# Altium project AUDIO.PrjPcb
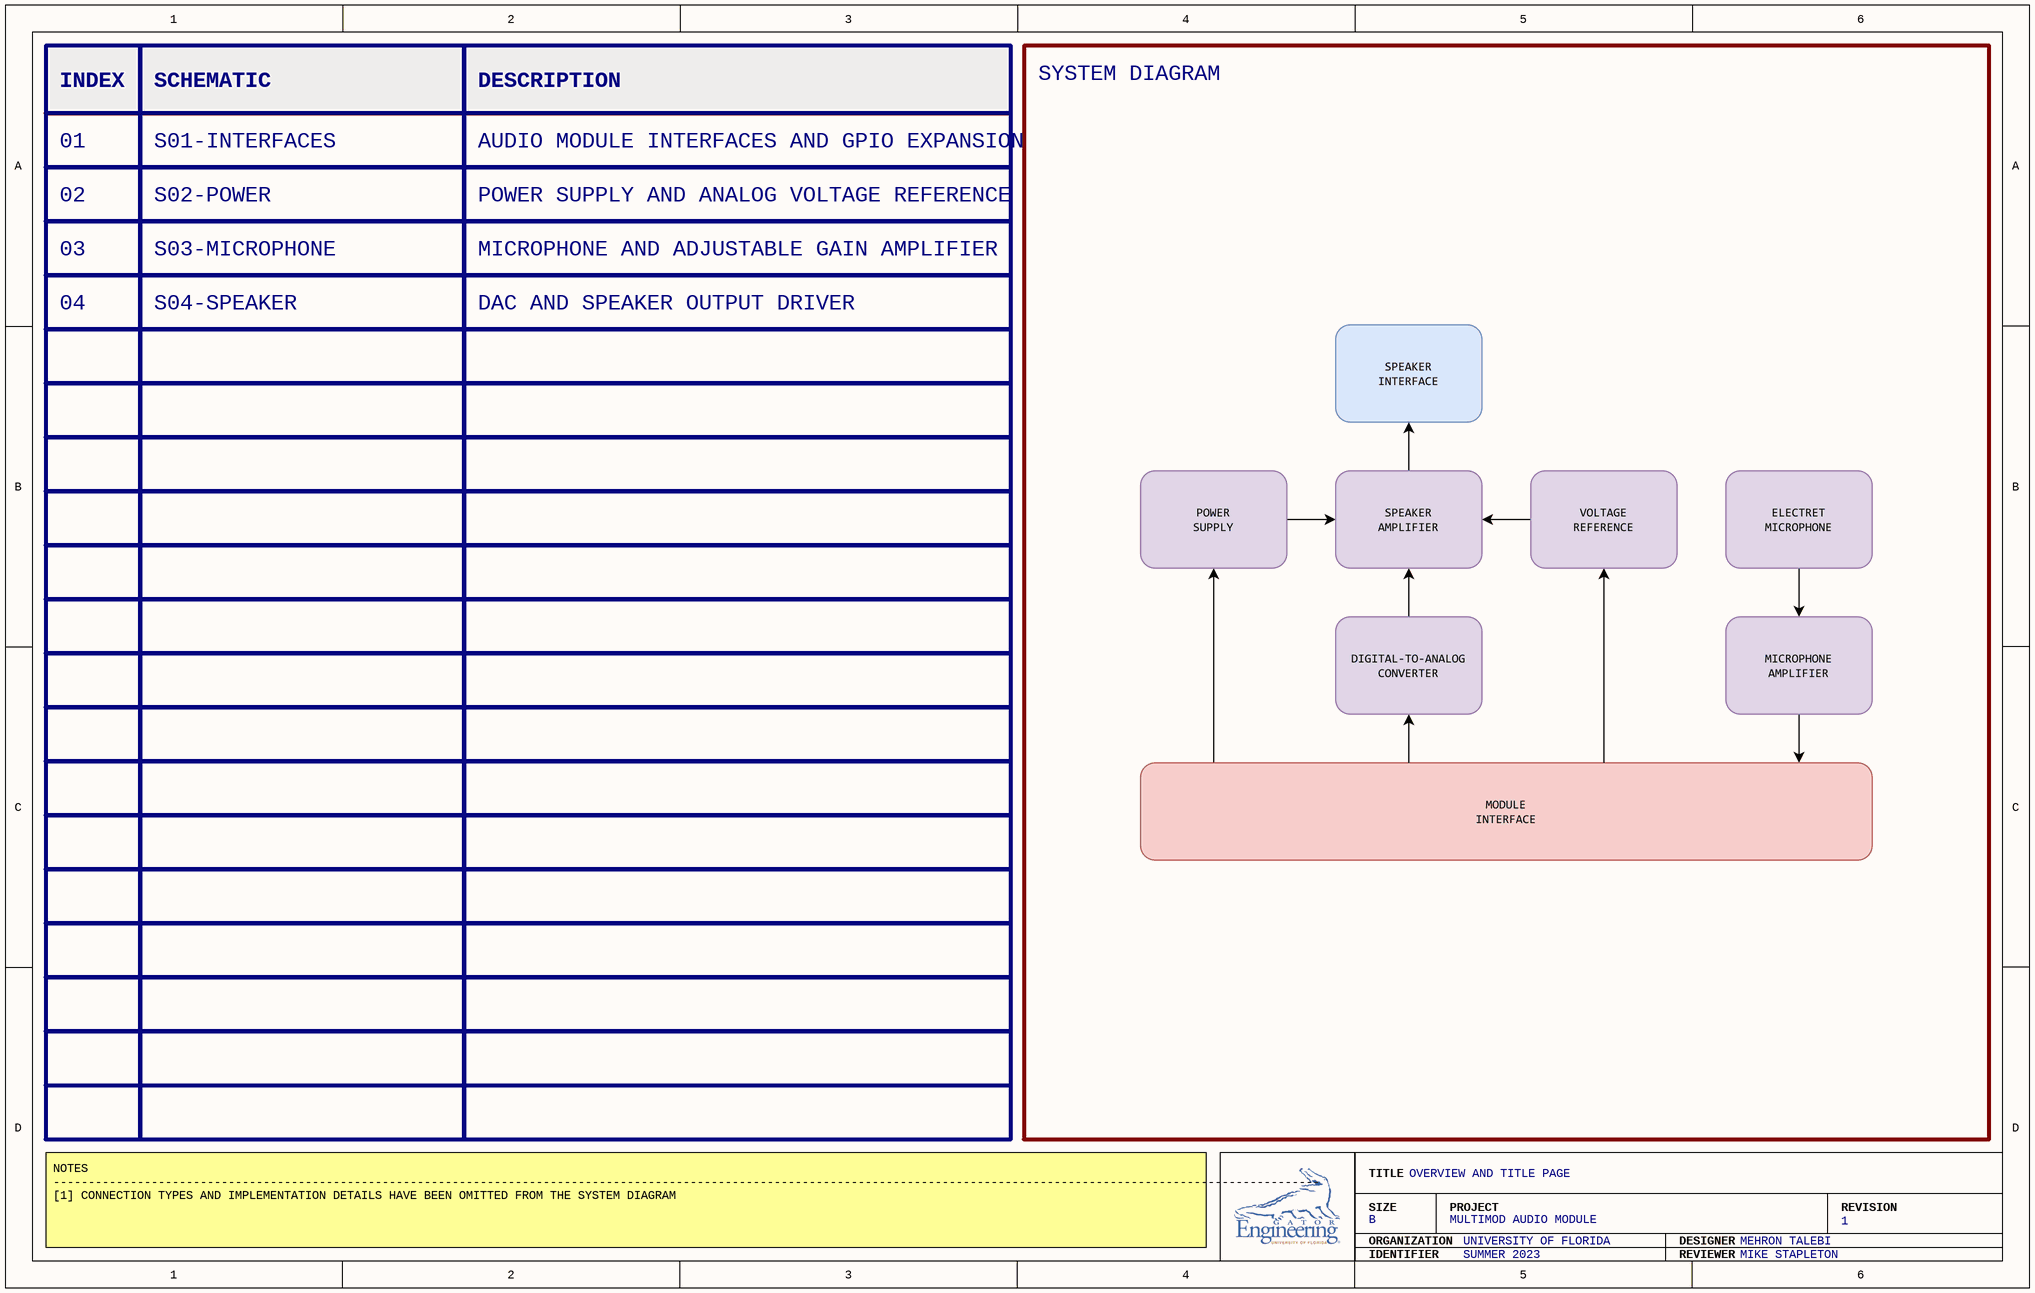
[diagram p0: S00-OVERVIEW.SchDoc]
5 sheets, 42 parts. Net scope: flat (ports and power ports of the same name join across sheets).
Board file: P01-AUDIO.PcbDoc
Sheets:
  S00-OVERVIEW.SchDoc
  S01-INTERFACES.SchDoc
  S02-POWER.SchDoc
  S03-MICROPHONE.SchDoc
  S04-SPEAKER.SchDoc

## Sheet S00-OVERVIEW.SchDoc
size B; SheetNumber: 1; SheetTotal: 5; BLOCK-TITLE: OVERVIEW AND TITLE PAGE; BLOCK-SIZE: B; BLOCK-PROJECT: MULTIMOD AUDIO MODULE; BLOCK-REVISION: 1; BLOCK-ORGANIZATION: UNIVERSITY OF FLORIDA; BLOCK-DESIGNER: MEHRON TALEBI; BLOCK-IDENTIFIER: SUMMER 2023; BLOCK-REVIEWER: MIKE STAPLETON

### Notes on the sheet
- INDEX
- SCHEMATIC
- DESCRIPTION
- SYSTEM DIAGRAM
- 01
- S01-INTERFACES
- AUDIO MODULE INTERFACES AND GPIO EXPANSION
- 02
- 03
- S02-POWER
- S03-MICROPHONE
- POWER SUPPLY AND ANALOG VOLTAGE REFERENCE
- MICROPHONE AND ADJUSTABLE GAIN AMPLIFIER
- 04
- S04-SPEAKER
- DAC AND SPEAKER OUTPUT DRIVER
- NOTES
  -------------------------------------------------------------------------------------------------------------------------------------------------------------------------------------
  [1] CONNECTION TYPES AND IMPLEMENTATION DETAILS HAVE BEEN OMITTED FROM THE SYSTEM DIAGRAM
- TITLE
- SIZE
- ORGANIZATION
- PROJECT
- DESIGNER
- REVISION
- IDENTIFIER
- REVIEWER

## Sheet S01-INTERFACES.SchDoc
size B; SheetNumber: 2; SheetTotal: 5; BLOCK-TITLE: AUDIO MODULE INTERFACES AND GPIO EXPANSION; BLOCK-SIZE: B; BLOCK-PROJECT: MULTIMOD AUDIO MODULE; BLOCK-REVISION: 1; BLOCK-ORGANIZATION: UNIVERSITY OF FLORIDA; BLOCK-DESIGNER: MEHRON TALEBI; BLOCK-IDENTIFIER: SUMMER 2023; BLOCK-REVIEWER: MIKE STAPLETON
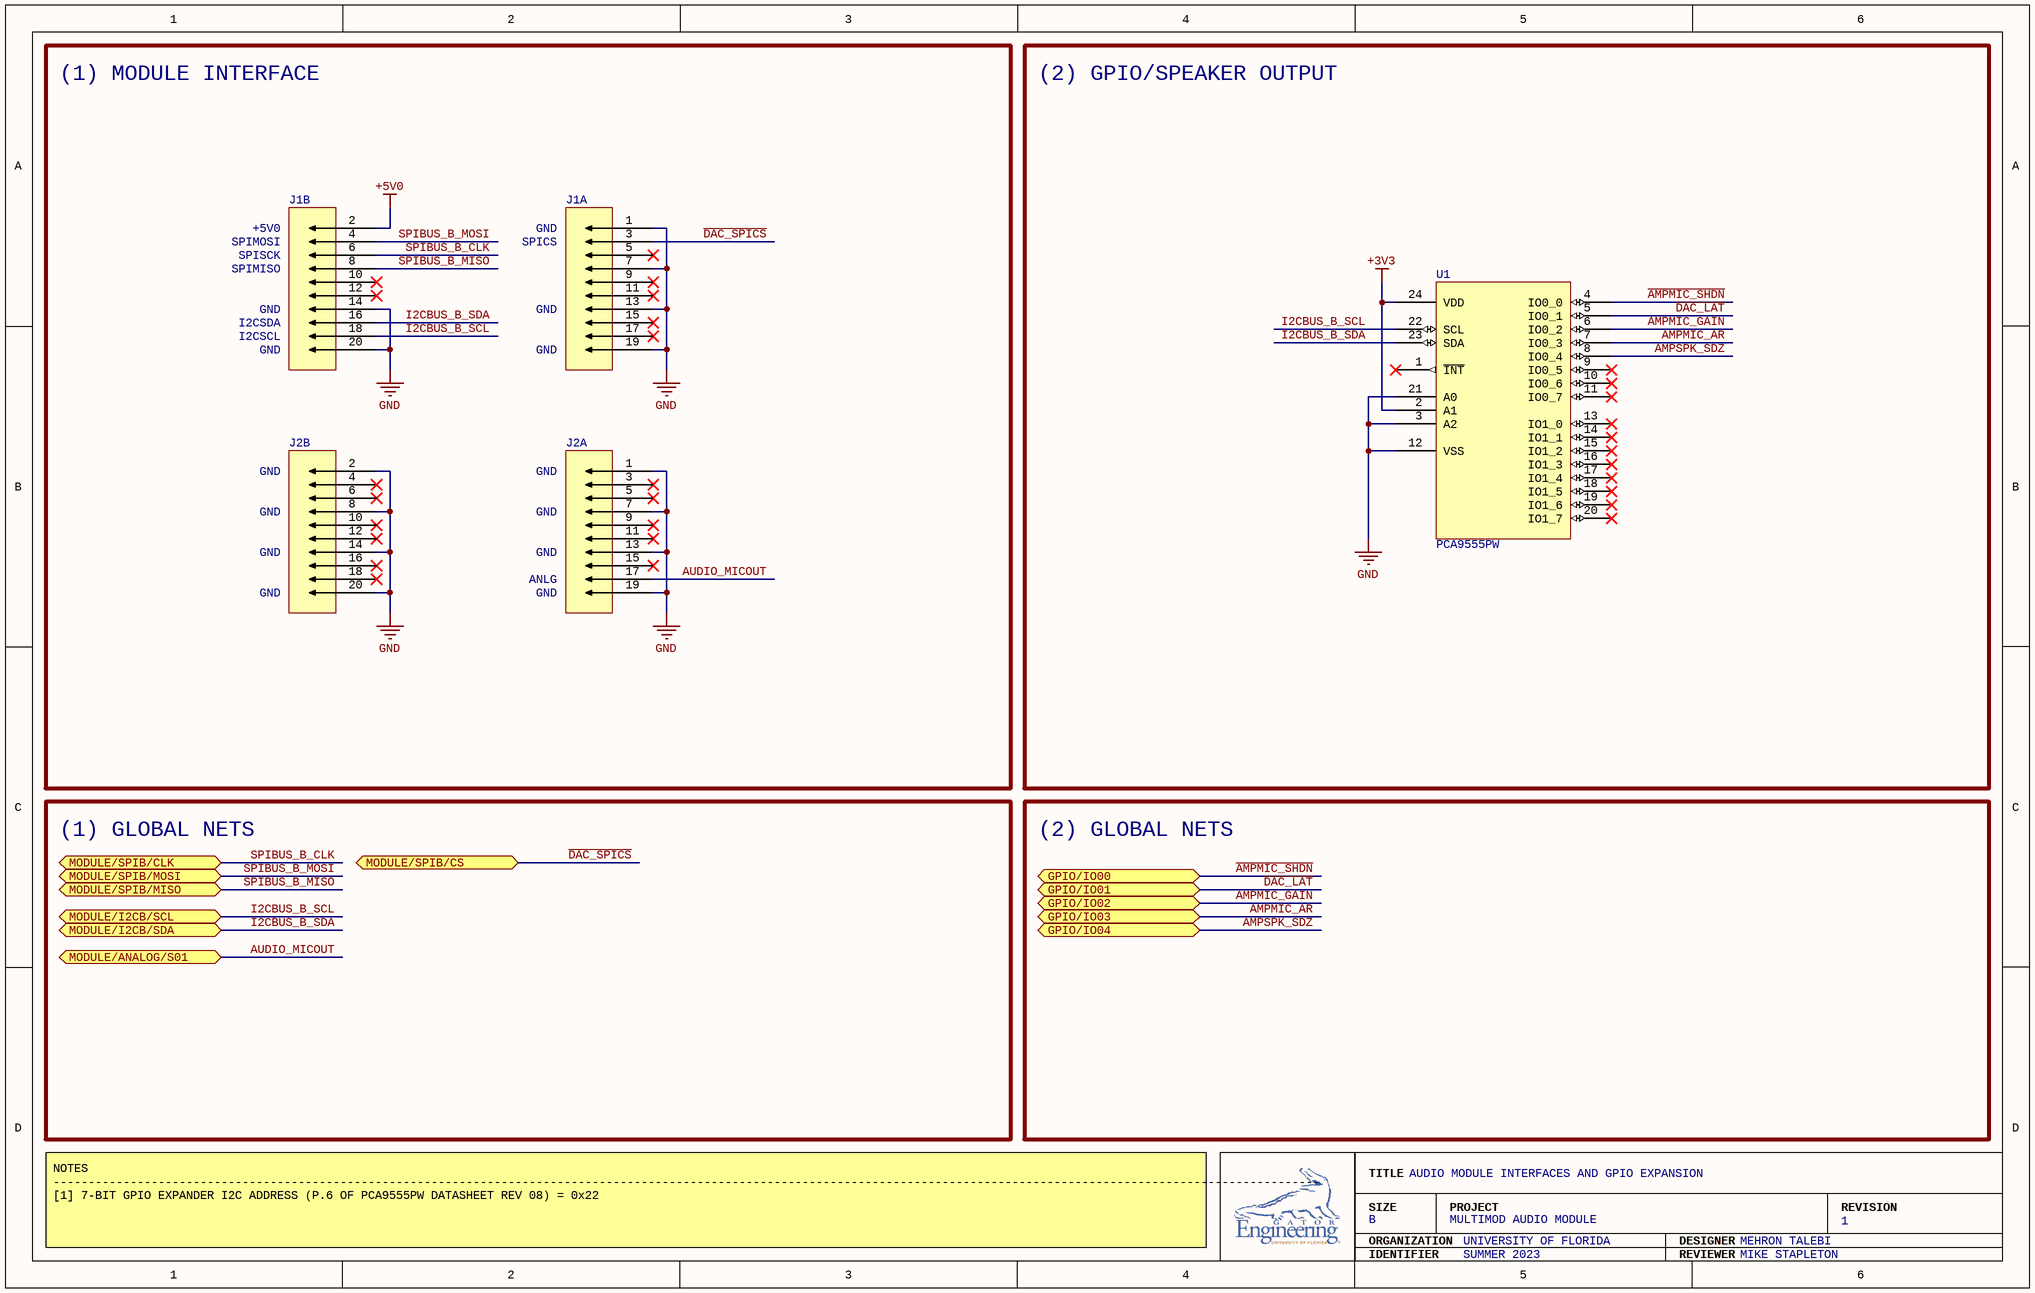
[diagram p1: S01-INTERFACES.SchDoc]

### Parts
J1  NPTC102KFMS-RC  [NPTC102KFMS-RC]  (value not drawn)  (parts A,B of 2)
J2  NPTC102KFMS-RC  [NPTC102KFMS-RC]  (value not drawn)  (parts A,B of 2)
U1  PCA9555PW  [PCA9555PW]

### Blocks framed on the sheet
(1) MODULE INTERFACE: J1 J2
(2) GPIO/SPEAKER OUTPUT: U1

### Ports
GPIO/IO00 (bidir), GPIO/IO01 (bidir), GPIO/IO02 (bidir), GPIO/IO03 (bidir), GPIO/IO04 (bidir), MODULE/ANALOG/S01 (bidir), MODULE/I2CB/SCL (bidir), MODULE/I2CB/SDA (bidir), MODULE/SPIB/CLK (bidir), MODULE/SPIB/CS (bidir), MODULE/SPIB/MISO (bidir), MODULE/SPIB/MOSI (bidir)

### Nets
+3V3: U1.2(A1) U1.24(VDD)
+5V0: J1.2
GND: J1.1 J1.7 J1.13 J1.14 J1.19 J1.20 J2.1 J2.2 J2.7 J2.8 J2.13 J2.14 J2.19 J2.20 U1.3(A2) U1.12(VSS) U1.21(A0)
~{AMPMIC_SHDN}: U1.4(IO0_0) ; port GPIO/IO00
~{DAC_LAT}: U1.5(IO0_1) ; port GPIO/IO01
~{DAC_SPICS}: J1.3 ; port MODULE/SPIB/CS
AMPMIC_AR: U1.7(IO0_3) ; port GPIO/IO03
AMPMIC_GAIN: U1.6(IO0_2) ; port GPIO/IO02
AMPSPK_SDZ: U1.8(IO0_4) ; port GPIO/IO04
AUDIO_MICOUT: J2.17 ; port MODULE/ANALOG/S01
I2CBUS_B_SCL: J1.18 U1.22(SCL) ; port MODULE/I2CB/SCL
I2CBUS_B_SDA: J1.16 U1.23(SDA) ; port MODULE/I2CB/SDA
SPIBUS_B_CLK: J1.6 ; port MODULE/SPIB/CLK
SPIBUS_B_MISO: J1.8 ; port MODULE/SPIB/MISO
SPIBUS_B_MOSI: J1.4 ; port MODULE/SPIB/MOSI

Not connected (* = marked no-connect by the designer): J1 5* 9* 10* 11* 12* 15* 17*; J2 3* 4* 5* 6* 9* 10* 11* 12* 15* 16* 18*; U1 1(~{INT})* 9(IO0_5)* 10(IO0_6)* 11(IO0_7)* 13(IO1_0)* 14(IO1_1)* 15(IO1_2)* 16(IO1_3)* 17(IO1_4)* 18(IO1_5)* 19(IO1_6)* 20(IO1_7)*

### Notes on the sheet
- +5V0
- SPIMOSI
- SPICS
- GND
- SPISCK
- SPIMISO
- I2CSCL
- I2CSDA
- ANLG
- (1) GLOBAL NETS
- (2) GLOBAL NETS
- NOTES
  -------------------------------------------------------------------------------------------------------------------------------------------------------------------------------------
  [1] 7-BIT GPIO EXPANDER I2C ADDRESS (P.6 OF PCA9555PW DATASHEET REV 08) = 0x22
- TITLE
- SIZE
- ORGANIZATION
- PROJECT
- DESIGNER
- REVISION
- IDENTIFIER
- REVIEWER

### Library data of the parts
J1 J2 = NPTC102KFMS-RC: CONN HDR 20POS 0.1 TIN SMD; Connector Type: Header; Style: Board to Board; Number of Positions: 20; Number of Positions Loaded: All; Pitch - Mating: 0.100" (2.54mm); Material Flammability Rating: UL94 V-0; Current Rating (Amps): 3A; Voltage Rating: 250V; System: Connector; Contact Type: Female Socket; Number of Rows: 2; Row Spacing - Mating: 0.100" (2.54mm); Mounting Type: Surface Mount; Termination: Solder; Fastening Type: Push-Pull; Contact Finish - Mating: Tin; Insulation Color: Black; Insulation Height: 0.299" (7.60mm); Operating Temperature: -40°C ~ 125°C; Contact Finish - Post: Tin; Insulation Material: Polyamide (PA6T), Nylon 6T; Contact Shape: Square; Contact Material: Phosphor Bronze; Supplier 1: Digi-Key; Supplier Part Number 1: S5680-ND
U1 = PCA9555PW: IC XPND 400KHZ I2C SMBUS 24TSSOP; Number of I/O: 16; Interface: I²C, SMBus; Interrupt Output: Yes; Output Type: Push-Pull; Current - Output Source/Sink: 10mA, 25mA; Voltage - Supply: 2.3V ~ 5.5V; Features: POR; Clock Frequency: 400 kHz; Operating Temperature: -40°C ~ 85°C; Mounting Type: Surface Mount; Package / Case: 24-TSSOP (0.173", 4.40mm Width); Supplier Device Package: 24-TSSOP; Supplier 1: Newark; Supplier Part Number 1: 24AC9600

## Sheet S02-POWER.SchDoc
size B; SheetNumber: 3; SheetTotal: 5; BLOCK-TITLE: POWER SUPPLY AND ANALOG VOLTAGE REFERENCE; BLOCK-SIZE: B; BLOCK-PROJECT: MULTIMOD AUDIO MODULE; BLOCK-REVISION: 1; BLOCK-ORGANIZATION: UNIVERSITY OF FLORIDA; BLOCK-DESIGNER: MEHRON TALEBI; BLOCK-IDENTIFIER: SUMMER 2023; BLOCK-REVIEWER: MIKE STAPLETON
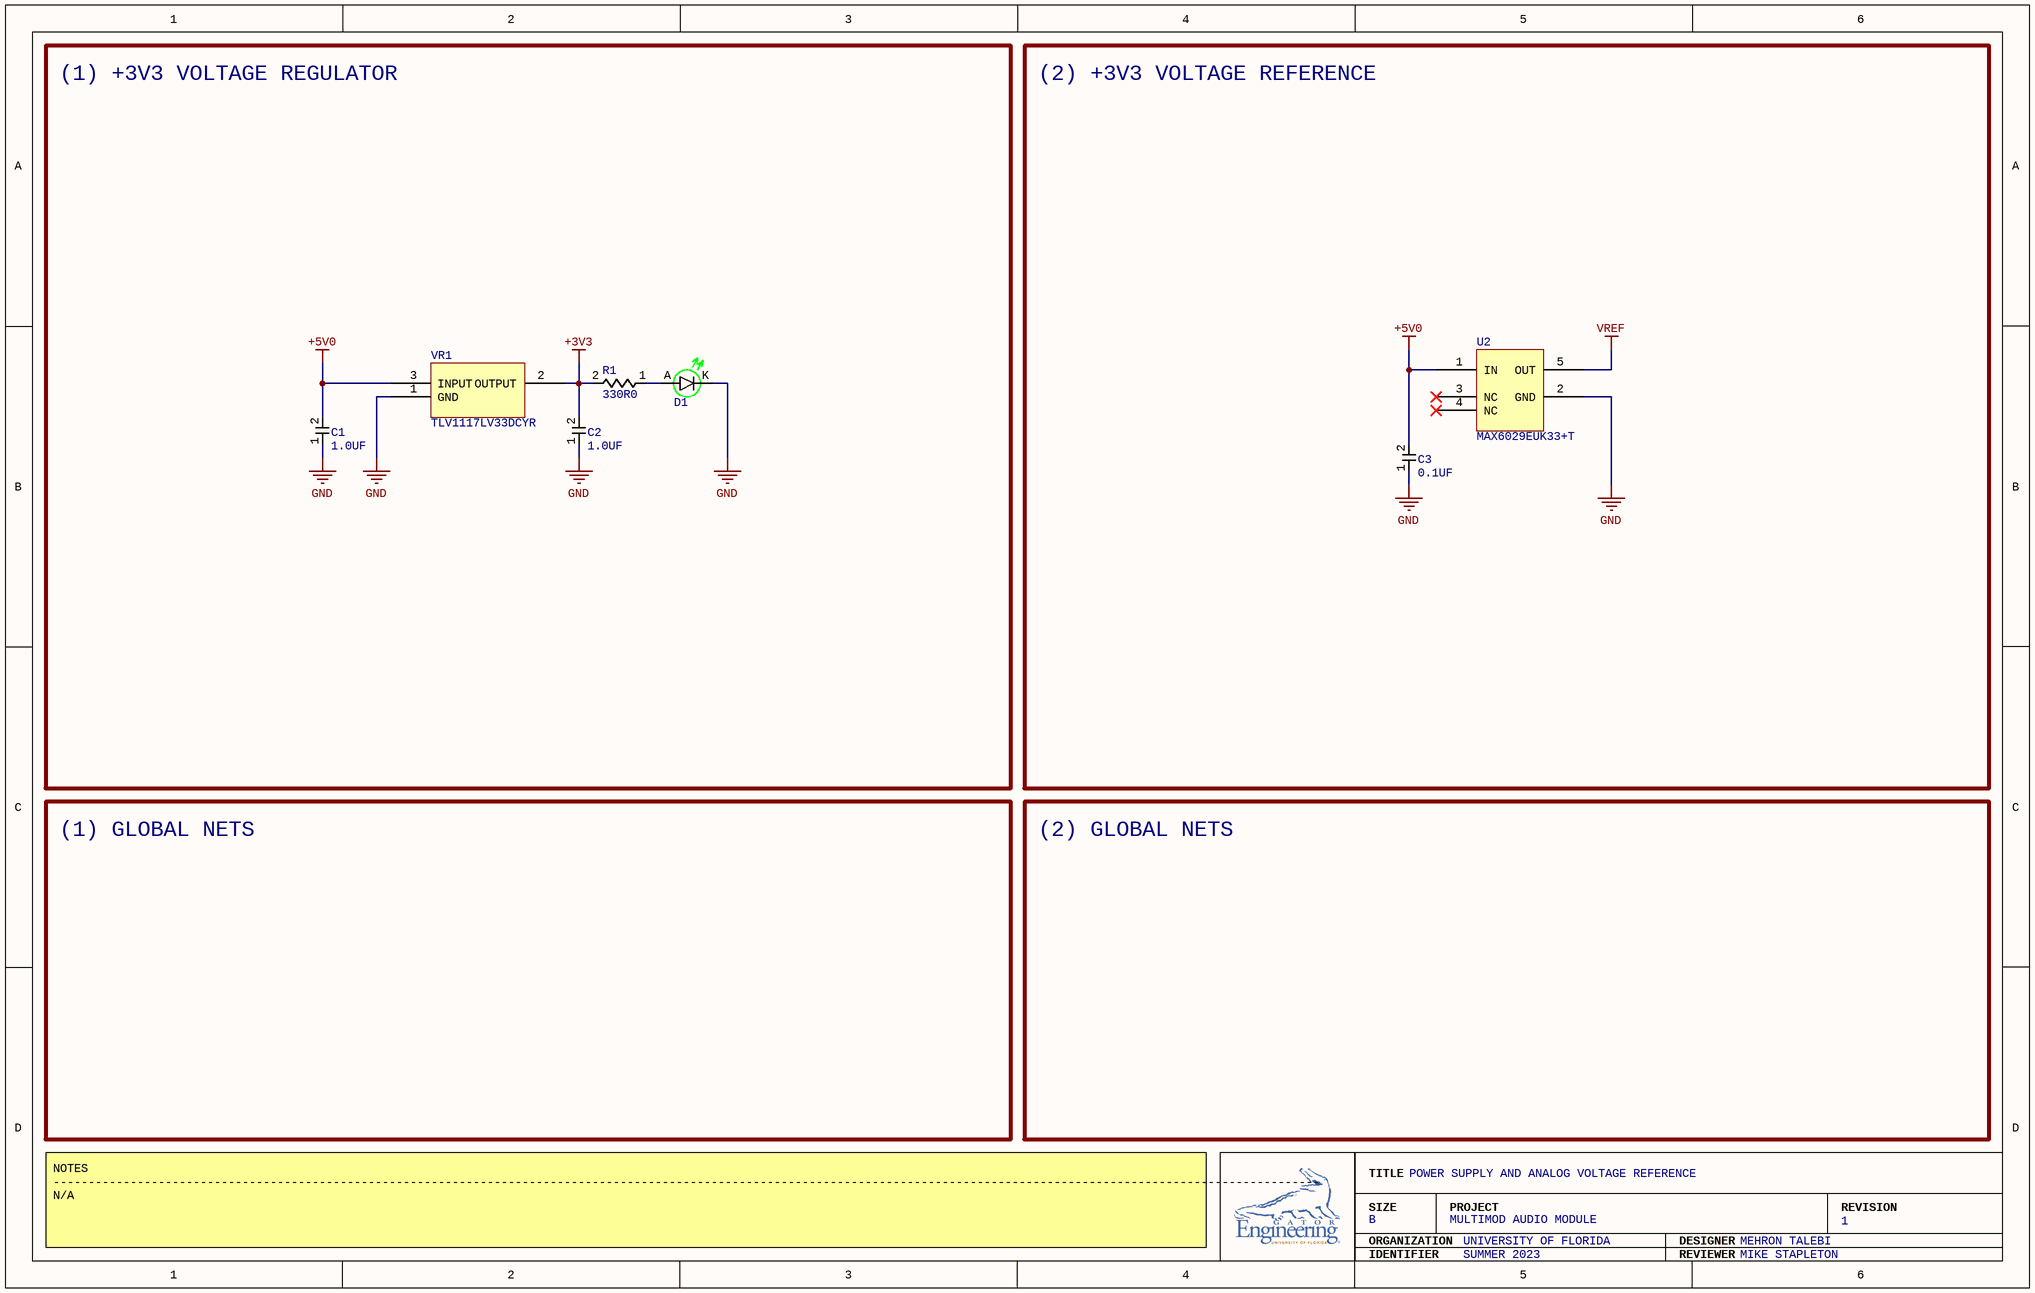
[diagram p2: S02-POWER.SchDoc]

### Parts
C1  1.0UF  [CL21B105KAFNFNE]
C2  1.0UF  [CL21B105KAFNFNE]
C3  0.1UF  [CL21B104KACNNNC]
D1  LTST-C171GKT  [LTST-C171GKT]  (value not drawn)
R1  330R0  [RC0805FR-7W330RL]
U2  MAX6029EUK33+T  [MAX6029EUK33+T]
VR1  TLV1117LV33DCYR  [TLV1117LV33DCYR]

### Blocks framed on the sheet
(1) +3V3 VOLTAGE REGULATOR: C1 C2 D1 R1 VR1
(2) +3V3 VOLTAGE REFERENCE: C3 U2

### Nets
+3V3: C2.2 R1.2 VR1.2(OUTPUT)
+5V0: C1.2 C3.2 U2.1(IN) VR1.3(INPUT)
GND: C1.1 C2.1 C3.1 D1.K U2.2(GND) VR1.1(GND)
VREF: U2.5(OUT)
NetD1_A: D1.A R1.1

Not connected (* = marked no-connect by the designer): U2 3(NC)* 4(NC)*

### Notes on the sheet
- (1) GLOBAL NETS
- (2) GLOBAL NETS
- NOTES
  -------------------------------------------------------------------------------------------------------------------------------------------------------------------------------------
  N/A
- TITLE
- SIZE
- ORGANIZATION
- PROJECT
- DESIGNER
- REVISION
- IDENTIFIER
- REVIEWER

### Library data of the parts
C1 C2 = CL21B105KAFNFNE: CAP CER 1UF 25V X7R 0805; Capacitance: 1 µF; Tolerance: ±10%; Voltage - Rated: 25V; Temperature Coefficient: X7R; Operating Temperature: -55°C ~ 125°C; Applications: General Purpose; Mounting Type: Surface Mount, MLCC; Package / Case: 0805 (2012 Metric); Size / Dimension: 0.079" L x 0.049" W (2.00mm x 1.25mm); Thickness (Max): 0.053" (1.35mm); Supplier 1: Arrow Electronics; Supplier Part Number 1: CL21B105KAFNFNE
C3 = CL21B104KACNNNC: CAP CER 0.1UF 25V X7R 0805; Capacitance: 0.1 µF; Tolerance: ±10%; ComponentLink1Description: Datasheet; ComponentLink1URL: https://media.digikey.com/pdf/Data%20Sheets/Samsung%20PDFs/CL21B105KAFNNNE_Spec.pdf; Voltage - Rated: 25V; Temperature Coefficient: X7R; Operating Temperature: -55°C ~ 125°C; Applications: General Purpose; Mounting Type: Surface Mount, MLCC; Package / Case: 0805 (2012 Metric); Size / Dimension: 0.079" L x 0.049" W (2.00mm x 1.25mm); Thickness (Max): 0.037" (0.95mm); Supplier 1: Arrow Electronics; Supplier Part Number 1: CL21B104KACNNNC
D1 = LTST-C171GKT: LED GREEN CLEAR CHIP SMD; Configuration: Standard; Lens Color: Colorless; Millicandela Rating: 12mcd; Lens Style: Rectangle with Flat Top; Lens Size: 1.40mm x 1.25mm; Voltage - Forward (Vf) (Typ): 2.1V; Current - Test: 20mA; Viewing Angle: 130°; Wavelength - Dominant: 569nm; Wavelength - Peak: 565nm; Color: Green; Lens Transparency: Clear; Mounting Type: Surface Mount; Package / Case: 0805 (2012 Metric); Supplier Device Package: Chip LED; Size / Dimension: 2.00mm L x 1.25mm W; Height (Max): 0.90mm; Supplier 1: Digi-Key; Supplier Part Number 1: 160-1423-1-ND
R1 = RC0805FR-7W330RL: RES 330 OHM 1% 1/4W 0805; Resistance: 330 Ohms; Power (Watts): 0.25W, 1/4W; Temperature Coefficient: ±100ppm/°C; Tolerance: ±1%; Composition: Thick Film; Features: Moisture Resistant; Operating Temperature: -55°C ~ 155°C; Supplier Device Package: 0805; Size / Dimension: 0.079" L x 0.049" W (2.00mm x 1.25mm); Height - Seated (Max): 0.024" (0.60mm); Number of Terminations: 2; Supplier 1: Mouser; Supplier Part Number 1: 603-RC0805FR-7W330RL
U2 = MAX6029EUK33+T: IC VREF SERIES 0.15% SOT23-5; Output Type: Fixed; Voltage - Output (Min/Fixed): 3.3V; Current - Output: 4 mA; Temperature Coefficient: 30ppm/°C; Noise - 0.1Hz to 10Hz: 56µVp-p; Noise - 10Hz to 10kHz: 174µVrms; Voltage - Input: 3.5V ~ 12.6V; Current - Supply: 7.25µA; Reference Type: Series; Tolerance: ±0.15%; Operating Temperature: -40°C ~ 85°C (TA); Mounting Type: Surface Mount; Package / Case: SC-74A, SOT-753; Supplier Device Package: SOT-23-5; Supplier 1: Digi-Key; Supplier Part Number 1: MAX6029EUK33+TCT-ND
VR1 = TLV1117LV33DCYR: IC REG LINEAR 3.3V 1A SOT223-4; Output Configuration: Positive; Output Type: Fixed; Number of Regulators: 1; Voltage - Input (Max): 5.5V; Voltage Dropout (Max): 1.3V @ 800mA; Current - Quiescent (Iq): 100 µA; PSRR: 75dB (120Hz); Protection Features: Over Current, Over Temperature; Voltage - Output (Min/Fixed): 3.3V; Current - Output: 1A; Operating Temperature: -40°C ~ 125°C; Mounting Type: Surface Mount; Package / Case: TO-261-4, TO-261AA; ComponentLink1Description: Datasheet; ComponentLink1URL: https://www.ti.com/lit/ds/symlink/tlv1117lv.pdf; Supplier 1: Digi-Key; Supplier Part Number 1: 296-28778-1-ND

## Sheet S03-MICROPHONE.SchDoc
size B; SheetNumber: 4; SheetTotal: 5; BLOCK-TITLE: MICROPHONE AND ADJUSTABLE GAIN AMPLIFIER; BLOCK-SIZE: B; BLOCK-PROJECT: MULTIMOD AUDIO MODULE; BLOCK-REVISION: 1; BLOCK-ORGANIZATION: UNIVERSITY OF FLORIDA; BLOCK-DESIGNER: MEHRON TALEBI; BLOCK-IDENTIFIER: SUMMER 2023; BLOCK-REVIEWER: MIKE STAPLETON
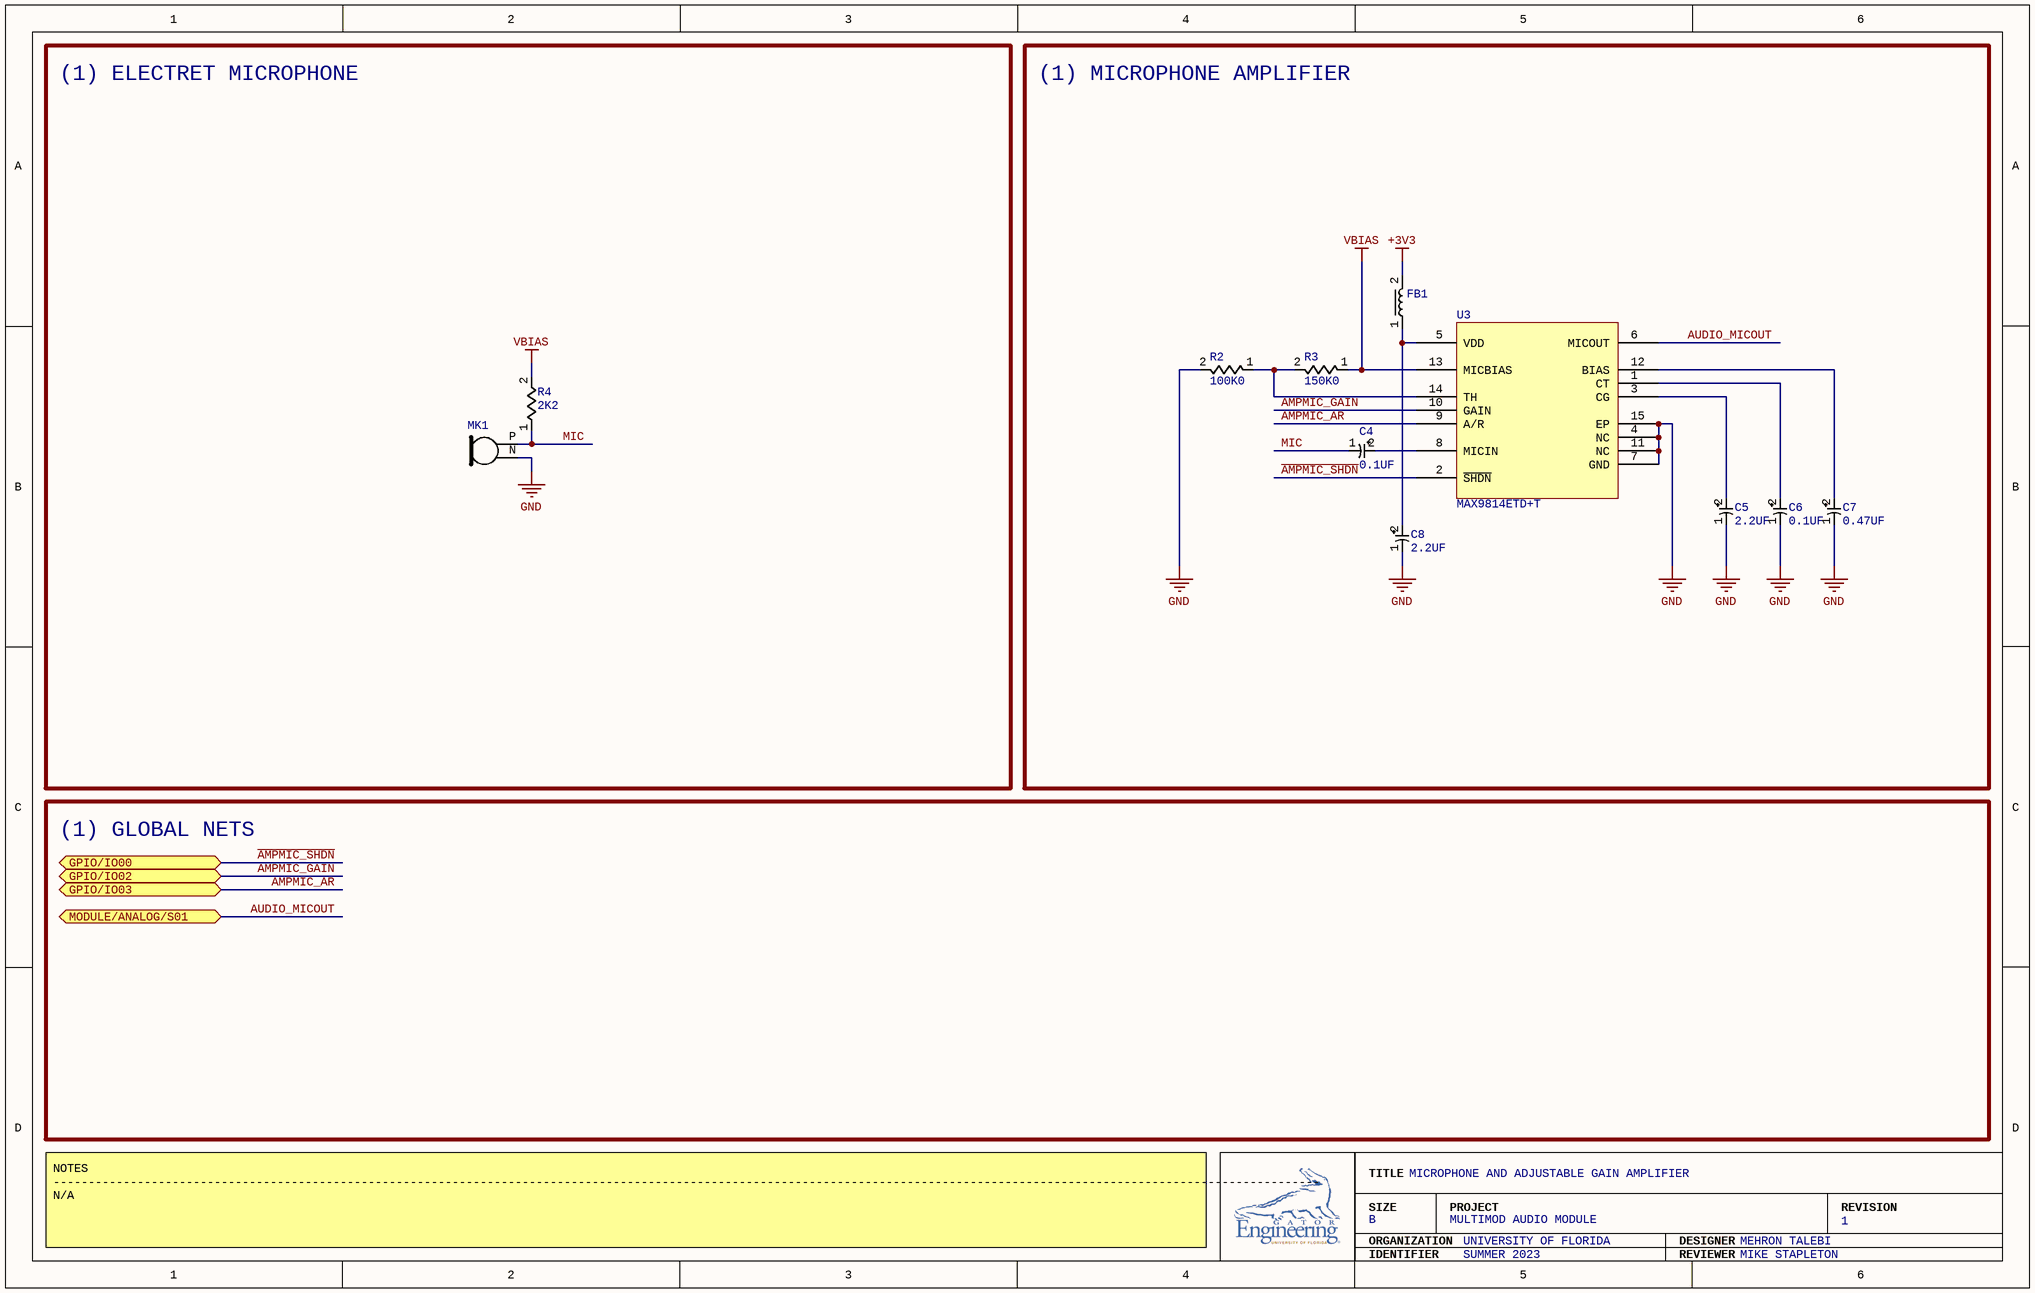
[diagram p3: S03-MICROPHONE.SchDoc]

### Parts
C4  0.1UF  [TAJR104K035RNJ]
C5  2.2UF  [TAJR225K020RNJ]
C6  0.1UF  [TAJR104K035RNJ]
C7  0.47UF  [TAJR474K020RNJ]
C8  2.2UF  [TAJR225K020RNJ]
FB1  ILBB0805ER102V  [ILBB0805ER102V]  (value not drawn)
MK1  CMA-4544PF-W  [CMA-4544PF-W]  (value not drawn)
R2  100K0  [RC0805FR-7W100KL]
R3  150K0  [RC0805FR-07150KL]
R4  2K2  [RC0805FR-072K2L]
U3  MAX9814ETD+T  [MAX9814ETD+T]

### Blocks framed on the sheet
(1) ELECTRET MICROPHONE: MK1 R4
(1) MICROPHONE AMPLIFIER: C4-C8 FB1 R2 R3 U3

### Ports
GPIO/IO00 (bidir), GPIO/IO02 (bidir), GPIO/IO03 (bidir), MODULE/ANALOG/S01 (bidir)

### Nets
+3V3: FB1.2
GND: C5.1 C6.1 C7.1 C8.1 MK1.N R2.2 U3.4(NC) U3.7(GND) U3.11(NC) U3.15(EP)
VBIAS: R3.1 R4.2 U3.13(MICBIAS)
~{AMPMIC_SHDN}: U3.2(~{SHDN}) ; port GPIO/IO00
AMPMIC_AR: U3.9(A/R) ; port GPIO/IO03
AMPMIC_GAIN: U3.10(GAIN) ; port GPIO/IO02
AUDIO_MICOUT: U3.6(MICOUT) ; port MODULE/ANALOG/S01
MIC: C4.1 MK1.P R4.1
NetC4_2: C4.2 U3.8(MICIN)
NetC5_2: C5.2 U3.3(CG)
NetC6_2: C6.2 U3.1(CT)
NetC7_2: C7.2 U3.12(BIAS)
NetC8_2: C8.2 FB1.1 U3.5(VDD)
NetR2_1: R2.1 R3.2 U3.14(TH)

### Notes on the sheet
- (1) GLOBAL NETS
- NOTES
  -------------------------------------------------------------------------------------------------------------------------------------------------------------------------------------
  N/A
- TITLE
- SIZE
- ORGANIZATION
- PROJECT
- DESIGNER
- REVISION
- IDENTIFIER
- REVIEWER

### Library data of the parts
C4 C6 = TAJR104K035RNJ: CAP TANT 0.1UF 10% 35V 0805; Manufacturer Size Code: R; Capacitance: 0.1 µF; Type: Molded; ESR (Equivalent Series Resistance): 29Ohm; Tolerance: ±10%; Voltage - Rated: 35 V; Operating Temperature: -55°C ~ 125°C; Mounting Type: Surface Mount; Package / Case: 0805 (2012 Metric); Size / Dimension: 0.081" L x 0.051" W (2.05mm x 1.30mm); Height - Seated (Max): 0.047" (1.20mm); Features: General Purpose; Supplier 1: Digi-Key; Supplier Part Number 1: 478-8926-1-ND
C5 C8 = TAJR225K020RNJ: CAP TANT 2.2UF 10% 20V 0805; Manufacturer Size Code: R; Capacitance: 2.2 µF; Type: Molded; ESR (Equivalent Series Resistance): 6Ohm; Tolerance: ±10%; Voltage - Rated: 20 V; Operating Temperature: -55°C ~ 125°C; Mounting Type: Surface Mount; Package / Case: 0805 (2012 Metric); Size / Dimension: 0.081" L x 0.051" W (2.05mm x 1.30mm); Height - Seated (Max): 0.047" (1.20mm); Features: General Purpose; Supplier 1: Digi-Key; Supplier Part Number 1: 478-4693-1-ND
C7 = TAJR474K020RNJ: CAP TANT 0.47UF 10% 20V 0805; Manufacturer Size Code: R; Capacitance: 0.47 µF; Type: Molded; ESR (Equivalent Series Resistance): 25Ohm; Tolerance: ±10%; Voltage - Rated: 20 V; Operating Temperature: -55°C ~ 125°C; Mounting Type: Surface Mount; Package / Case: 0805 (2012 Metric); Size / Dimension: 0.081" L x 0.051" W (2.05mm x 1.30mm); Height - Seated (Max): 0.047" (1.20mm); Features: General Purpose; Supplier 1: Digi-Key; Supplier Part Number 1: 478-3964-1-ND
FB1 = ILBB0805ER102V: FERRITE BEAD 1K OHM 0805 1LN; Number of Lines: 1; Impedance @ Frequency: 1 kOhms @ 100 MHz; Current Rating (Max): 100mA; DC Resistance (DCR) (Max): 350mOhm; Operating Temperature: -55°C ~ 125°C; Package / Case: 0805 (2012 Metric); Mounting Type: Surface Mount; Height (Max): 0.043" (1.10mm); Size / Dimension: 0.079" L x 0.049" W (2.00mm x 1.25mm); Supplier 1: Digi-Key; Supplier Part Number 1: 541-2293-1-ND
MK1 = CMA-4544PF-W: MIC COND ANLG OMNI -44DB 0.382"D; Output Type: Analog; Direction: Omnidirectional; Frequency Range: 20 Hz ~ 20 kHz; Sensitivity: -44dB ±2dB; S/N Ratio: 60dB; Impedance: 2.2 kOhms; Voltage Range: 3 V ~ 10 V; Current - Supply: 500 µA; Port Location: Top; Shape: Circular; Type: Electret Condenser; Termination: PC Pins; Size / Dimension: 0.382" Dia (9.70mm); Height (Max): 0.183" (4.65mm); Supplier 1: Arrow Electronics; Supplier Part Number 1: CMA-4544PF-W
R2 = RC0805FR-7W100KL: RES 100K OHM 1% 1/4W 0805; Resistance: 100 kOhms; Power (Watts): 0.25W, 1/4W; Temperature Coefficient: ±100ppm/°C; Tolerance: ±1%; Composition: Thick Film; Features: Moisture Resistant; Operating Temperature: -55°C ~ 155°C; Supplier Device Package: 0805; Size / Dimension: 0.079" L x 0.049" W (2.00mm x 1.25mm); Height - Seated (Max): 0.024" (0.60mm); Number of Terminations: 2; Supplier 1: Mouser; Supplier Part Number 1: 603-RC0805FR-7W100KL
R3 = RC0805FR-07150KL: RES 150K OHM 1% 1/8W 0805; Resistance: 150 kOhms; Power (Watts): 0.125W, 1/8W; Temperature Coefficient: ±100ppm/°C; Tolerance: ±1%; Composition: Thick Film; Features: Moisture Resistant; Operating Temperature: -55°C ~ 155°C; Package / Case: 0805 (2012 Metric); Supplier Device Package: 0805; Size / Dimension: 0.079" L x 0.049" W (2.00mm x 1.25mm); Height - Seated (Max): 0.024" (0.60mm); Number of Terminations: 2; Supplier 1: Digi-Key; Supplier Part Number 1: 311-150KCRDKR-ND
R4 = RC0805FR-072K2L: RES 2.2K OHM 1% 1/8W 0805; Resistance: 2.2 kOhms; Power (Watts): 0.125W, 1/8W; Temperature Coefficient: ±100ppm/°C; Tolerance: ±1%; Composition: Thick Film; Features: Moisture Resistant; Operating Temperature: -55°C ~ 155°C; Package / Case: 0805 (2012 Metric); Supplier Device Package: 0805; Size / Dimension: 0.079" L x 0.049" W (2.00mm x 1.25mm); Height - Seated (Max): 0.024" (0.60mm); Number of Terminations: 2; Supplier 1: Digi-Key; Supplier Part Number 1: 311-2.20KCRDKR-ND
U3 = MAX9814ETD+T: IC AMP CLASS AB MONO 14TDFN; Output Type: 1-Channel (Mono); Voltage - Supply: 2.7V ~ 5.5V; Type: Class AB; Features: AGC, Microphone, Shutdown; Mounting Type: Surface Mount; Operating Temperature: -40°C ~ 85°C (TA); Supplier Device Package: 14-TDFN (3x3); Package / Case: 14-WFDFN Exposed Pad; Supplier 1: Digi-Key; Supplier Part Number 1: MAX9814ETD+TCT-ND

## Sheet S04-SPEAKER.SchDoc
size B; SheetNumber: 5; SheetTotal: 5; BLOCK-TITLE: DAC AND SPEAKER OUTPUT DRIVER; BLOCK-SIZE: B; BLOCK-PROJECT: MULTIMOD AUDIO MODULE; BLOCK-REVISION: 1; BLOCK-ORGANIZATION: UNIVERSITY OF FLORIDA; BLOCK-DESIGNER: MEHRON TALEBI; BLOCK-IDENTIFIER: SUMMER 2023; BLOCK-REVIEWER: MIKE STAPLETON
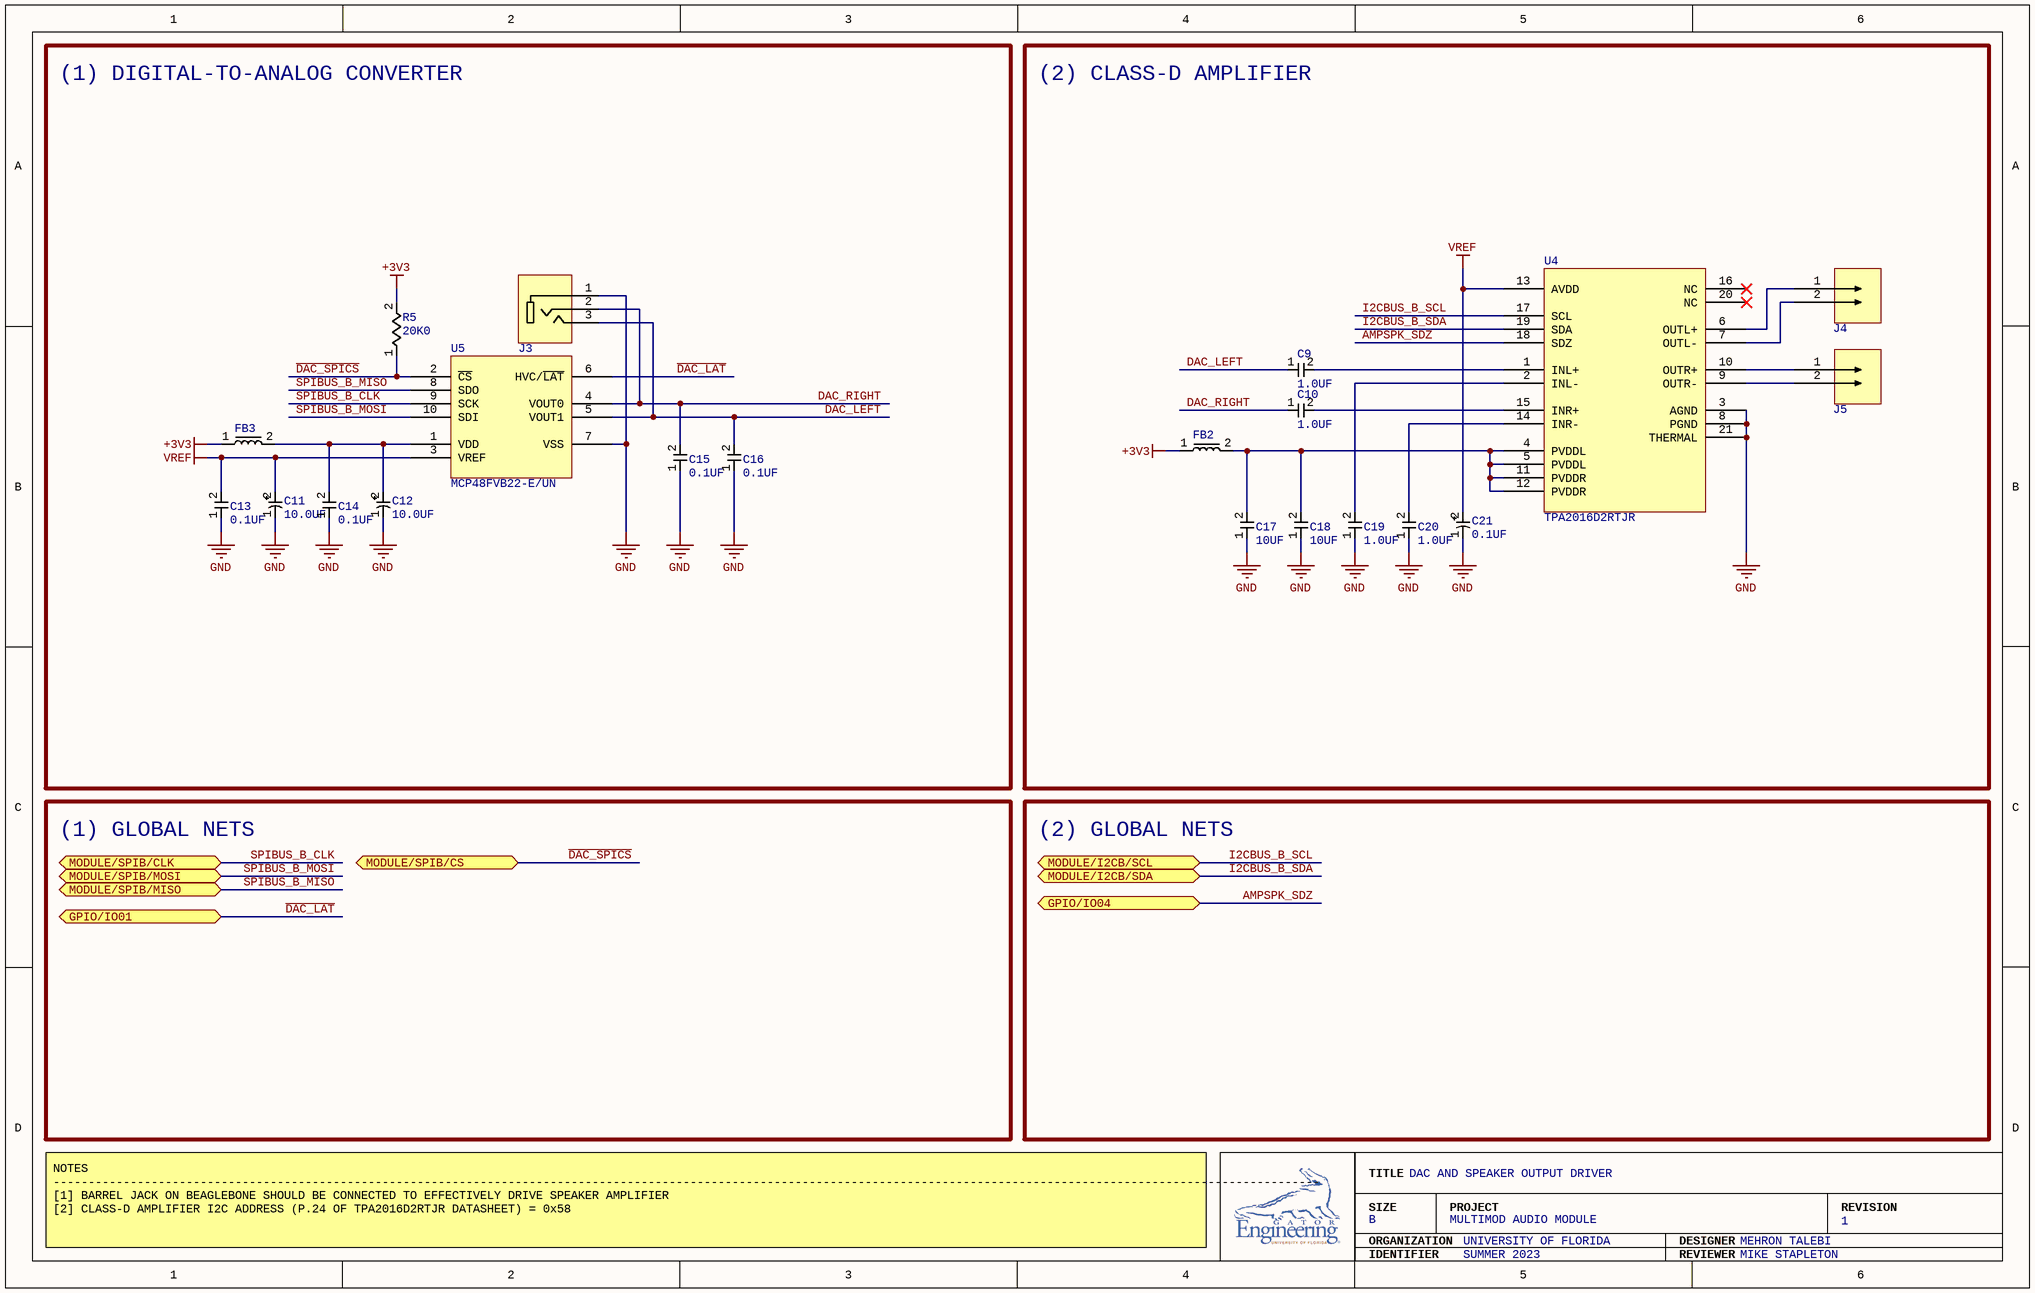
[diagram p4: S04-SPEAKER.SchDoc]

### Parts
C9  1.0UF  [CL21B105KAFNFNE]
C10  1.0UF  [CL21B105KAFNFNE]
C11  10.0UF  [TAJR106M006RNJ]
C12  10.0UF  [TAJR106M006RNJ]
C13  0.1UF  [CL21B104KACNNNC]
C14  0.1UF  [CL21B104KACNNNC]
C15  0.1UF  [CL21B104KACNNNC]
C16  0.1UF  [CL21B104KACNNNC]
C17  10UF  [CL21B106KPQNFNE]
C18  10UF  [CL21B106KPQNFNE]
C19  1.0UF  [CL21B105KAFNFNE]
C20  1.0UF  [CL21B105KAFNFNE]
C21  0.1UF  [TAJR104K035RNJ]
FB2  BLM21PG221SN1D  [BLM21PG221SN1D]  (value not drawn)
FB3  ILBB0805ER102V  [ILBB0805ER102V]  (value not drawn)
J3  SJ-3523-SMT-TR  [SJ-3523-SMT-TR]  (value not drawn)
J4  TB001-500-02BE  [TB001-500-02BE]  (value not drawn)
J5  TB001-500-02BE  [TB001-500-02BE]  (value not drawn)
R5  20K0  [RC0805FR-074K7L]
U4  TPA2016D2RTJR  [TPA2016D2RTJR]
U5  MCP48FVB22-E/UN  [MCP48FVB22-E/UN]

### Blocks framed on the sheet
(1) DIGITAL-TO-ANALOG CONVERTER: C11-C16 FB3 J3 R5 U5
(2) CLASS-D AMPLIFIER: C9 C10 C17-C21 FB2 J4 J5 U4

### Ports
GPIO/IO01 (bidir), GPIO/IO04 (bidir), MODULE/I2CB/SCL (bidir), MODULE/I2CB/SDA (bidir), MODULE/SPIB/CLK (bidir), MODULE/SPIB/CS (bidir), MODULE/SPIB/MISO (bidir), MODULE/SPIB/MOSI (bidir)

### Nets
+3V3: FB2.1 FB3.1 R5.2
GND: C11.1 C12.1 C13.1 C14.1 C15.1 C16.1 C17.1 C18.1 C19.1 C20.1 C21.1 J3.1 U4.3(AGND) U4.8(PGND) U4.21(THERMAL) U5.7(VSS)
VREF: C11.2 C13.2 C21.2 U4.13(AVDD) U5.3(VREF)
~{DAC_LAT}: U5.6(HVC/~{LAT}) ; port GPIO/IO01
~{DAC_SPICS}: R5.1 U5.2(~{CS}) ; port MODULE/SPIB/CS
AMPSPK_SDZ: U4.18(SDZ) ; port GPIO/IO04
DAC_LEFT: C9.1 C16.2 J3.3 U5.5(VOUT1)
DAC_RIGHT: C10.1 C15.2 J3.2 U5.4(VOUT0)
I2CBUS_B_SCL: U4.17(SCL) ; port MODULE/I2CB/SCL
I2CBUS_B_SDA: U4.19(SDA) ; port MODULE/I2CB/SDA
SPIBUS_B_CLK: U5.9(SCK) ; port MODULE/SPIB/CLK
SPIBUS_B_MISO: U5.8(SDO) ; port MODULE/SPIB/MISO
SPIBUS_B_MOSI: U5.10(SDI) ; port MODULE/SPIB/MOSI
NetC9_2: C9.2 U4.1(INL+)
NetC10_2: C10.2 U4.15(INR+)
NetC12_2: C12.2 C14.2 FB3.2 U5.1(VDD)
NetC17_2: C17.2 C18.2 FB2.2 U4.4(PVDDL) U4.5(PVDDL) U4.11(PVDDR) U4.12(PVDDR)
NetC19_2: C19.2 U4.2(INL-)
NetC20_2: C20.2 U4.14(INR-)
NetJ4_1: J4.1 U4.6(OUTL+)
NetJ4_2: J4.2 U4.7(OUTL-)
NetJ5_1: J5.1 U4.10(OUTR+)
NetJ5_2: J5.2 U4.9(OUTR-)

Not connected (* = marked no-connect by the designer): U4 16(NC)* 20(NC)*

### Notes on the sheet
- (1) GLOBAL NETS
- (2) GLOBAL NETS
- NOTES
  -------------------------------------------------------------------------------------------------------------------------------------------------------------------------------------
  [1] BARREL JACK ON BEAGLEBONE SHOULD BE CONNECTED TO EFFECTIVELY DRIVE SPEAKER AMPLIFIER
  [2] CLASS-D AMPLIFIER I2C ADDRESS (P.24 OF TPA2016D2RTJR DATASHEET) = 0x58
- TITLE
- SIZE
- ORGANIZATION
- PROJECT
- DESIGNER
- REVISION
- IDENTIFIER
- REVIEWER

### Library data of the parts
C9 C10 C19 C20 = CL21B105KAFNFNE: as C1 on sheet S02-POWER; Voltage - Rated: 25V; Temperature Coefficient: X7R; Operating Temperature: -55°C ~ 125°C; Applications: General Purpose; Mounting Type: Surface Mount, MLCC; Package / Case: 0805 (2012 Metric); Size / Dimension: 0.079" L x 0.049" W (2.00mm x 1.25mm); Thickness (Max): 0.053" (1.35mm); Supplier 1: Arrow Electronics; Supplier Part Number 1: CL21B105KAFNFNE
C11 C12 = TAJR106M006RNJ: CAP TANT 10UF 20% 6.3V 0805; Manufacturer Size Code: R; Capacitance: 10 µF; Type: Molded; ESR (Equivalent Series Resistance): 6Ohm; Tolerance: ±20%; Voltage - Rated: 6.3 V; Operating Temperature: -55°C ~ 125°C; Mounting Type: Surface Mount; Package / Case: 0805 (2012 Metric); Size / Dimension: 0.081" L x 0.051" W (2.05mm x 1.30mm); Height - Seated (Max): 0.047" (1.20mm); Features: General Purpose; Supplier 1: Arrow Electronics; Supplier Part Number 1: TAJR106M006RNJ
C13-C16 = CL21B104KACNNNC: as C3 on sheet S02-POWER; ComponentLink1Description: Datasheet; ComponentLink1URL: https://media.digikey.com/pdf/Data%20Sheets/Samsung%20PDFs/CL21B105KAFNNNE_Spec.pdf; Voltage - Rated: 25V; Temperature Coefficient: X7R; Operating Temperature: -55°C ~ 125°C; Applications: General Purpose; Mounting Type: Surface Mount, MLCC; Package / Case: 0805 (2012 Metric); Size / Dimension: 0.079" L x 0.049" W (2.00mm x 1.25mm); Thickness (Max): 0.037" (0.95mm); Supplier 1: Arrow Electronics; Supplier Part Number 1: CL21B104KACNNNC
C17 C18 = CL21B106KPQNFNE: CAP CER 10UF 10V X7R 0805; Capacitance: 10 µF; Tolerance: ±10%; Voltage - Rated: 10V; Temperature Coefficient: X7R; Operating Temperature: -55°C ~ 125°C; Applications: General Purpose; Mounting Type: Surface Mount, MLCC; Package / Case: 0805 (2012 Metric); Size / Dimension: 0.079" L x 0.049" W (2.00mm x 1.25mm); Thickness (Max): 0.053" (1.35mm); Supplier 1: Arrow Electronics; Supplier Part Number 1: CL21B106KPQNFNE
C21 = TAJR104K035RNJ: as C4 on sheet S03-MICROPHONE; Tolerance: ±10%; Voltage - Rated: 35 V; Operating Temperature: -55°C ~ 125°C; Mounting Type: Surface Mount; Package / Case: 0805 (2012 Metric); Size / Dimension: 0.081" L x 0.051" W (2.05mm x 1.30mm); Height - Seated (Max): 0.047" (1.20mm); Features: General Purpose; Supplier 1: Digi-Key; Supplier Part Number 1: 478-8926-1-ND
FB2 = BLM21PG221SN1D: FERRITE BEAD 220 OHM 0805 1LN; Filter Type: Power Line; Number of Lines: 1; Impedance @ Frequency: 220 Ohms @ 100 MHz; Current Rating (Max): 2A; DC Resistance (DCR) (Max): 45mOhm; Operating Temperature: -55°C ~ 125°C; Package / Case: 0805 (2012 Metric); Mounting Type: Surface Mount; Height (Max): 0.041" (1.05mm); Size / Dimension: 0.079" L x 0.049" W (2.00mm x 1.25mm); Supplier 1: Arrow Electronics; Supplier Part Number 1: BLM21PG221SN1D
FB3 = ILBB0805ER102V: as FB1 on sheet S03-MICROPHONE; Operating Temperature: -55°C ~ 125°C; Package / Case: 0805 (2012 Metric); Mounting Type: Surface Mount; Height (Max): 0.043" (1.10mm); Size / Dimension: 0.079" L x 0.049" W (2.00mm x 1.25mm); Supplier 1: Digi-Key; Supplier Part Number 1: 541-2293-1-ND
J3 = SJ-3523-SMT-TR: CONN JACK STEREO 3.5MM SMD R/A; Connector Type: Phone Jack; Gender: Female; Signal Lines: Stereo (3 Conductor, TRS); Industry Recognized Mating Diameter: 3.50mm (0.141", 1/8", Mini Plug) - Headphone; Actual Diameter: 0.142" (3.60mm); Number of Positions/Contacts: 3 Conductors, 3 Contacts; Internal Switch(s): Does Not Contain Switch; Shielding: Unshielded; Voltage - Rated: 12VDC; Current Rating (Amps): 1 A; Mating Length/Depth: 0.551" (14.00mm); Body Color: Black; Mounting Type: Surface Mount, Right Angle; Termination: Solder; Features: Board Guide; Operating Temperature: -25°C ~ 85°C; Contact Material - Plating: Silver; Housing Material: Polyamide (PA6T), Nylon 6T; Contact Material: Brass, Copper Alloy; Supplier 1: Digi-Key; Supplier Part Number 1: CP-3523SJCT-ND
J4 J5 = TB001-500-02BE: TERMINAL BLOCK, SCREW TYPE, 5.00; Number of Levels: 1; Positions Per Level: 2; Pitch: 0.197" (5.00mm); Mating Orientation: Horizontal with Board; Current: 15 A; Voltage: 300 V; Wire Gauge: 12-22 AWG; Wire Termination: Screw - Leaf Spring, Wire Guard; Clamp Material - Plating: Steel, Stainless; Screw Material - Plating: Steel - Zinc Plated; Torque - Screw: 0.5 Nm (4.4 Lb-In); Screw Thread: M3; Mounting Type: Through Hole; Features: Interlocking (Side); Color: Blue; Operating Temperature: -40°C ~ 105°C; Housing Material: Polybutylene Terephthalate (PBT); Contact Material - Plating: Copper Alloy - Tin Plated; Supplier 1: Digi-Key; Supplier Part Number 1: 102-6134-ND
R5 = RC0805FR-0720KL: RES 20K OHM 1% 1/8W 0805; Resistance: 20 kOhms; Power (Watts): 0.125W, 1/8W; Temperature Coefficient: ±100ppm/°C; Tolerance: ±1%; Composition: Thick Film; Features: Moisture Resistant; Operating Temperature: -55°C ~ 155°C; Package / Case: 0805 (2012 Metric); Size / Dimension: 0.079" L x 0.049" W (2.00mm x 1.25mm); Height - Seated (Max): 0.024" (0.60mm); Number of Terminations: 2; Supplier 1: Digi-Key; Supplier Part Number 1: 311-20.0KCRCT-ND
U4 = TPA2016D2RTJR: IC AMP CLASS D STEREO 2.8W 20QFN; Output Type: 2-Channel (Stereo); Max Output Power x Channels @ Load: 2.8W x 2 @ 4Ohm; Voltage - Supply: 2.5V ~ 5.5V; Type: Class D; Features: Differential Inputs, I²C, Short-Circuit and Thermal Protection, Shutdown, Volume Control; Mounting Type: Surface Mount; Operating Temperature: -40°C ~ 85°C (TA); Supplier Device Package: 20-QFN (4x4); Package / Case: 20-WFQFN Exposed Pad; Supplier 1: Digi-Key; Supplier Part Number 1: 296-25430-1-ND
U5 = MCP48FVB22-E/UN: IC DAC 12BIT V-OUT 10MSOP; Number of Bits: 12; Number of D/A Converters: 2; Settling Time: 7.8µs (Typ); Output Type: Voltage - Buffered; Differential Output: No; Data Interface: SPI; Reference Type: External, Internal; Voltage - Supply, Analog: 2.7V ~ 5.5V; INL/DNL (LSB): ±1.5, ±0.2; Architecture: R-2R; Voltage - Supply, Digital: 2.7V ~ 5.5V; Operating Temperature: -40°C ~ 125°C; Package / Case: 10-TFSOP, 10-MSOP (0.118", 3.00mm Width); Supplier Device Package: 10-MSOP; Mounting Type: Surface Mount; Supplier 1: Digi-Key; Supplier Part Number 1: MCP48FVB22-E/UN-ND

## Nets that join several sheets
+3V3: S01-INTERFACES (U1.2 U1.24), S02-POWER (C2.2 R1.2 VR1.2), S03-MICROPHONE (FB1.2), S04-SPEAKER (FB2.1 FB3.1 R5.2)
+5V0: S01-INTERFACES (J1.2), S02-POWER (C1.2 C3.2 U2.1 VR1.3)
GND: S01-INTERFACES (17 pins), S02-POWER (6 pins), S03-MICROPHONE (10 pins), S04-SPEAKER (16 pins)
VREF: S02-POWER (U2.5), S04-SPEAKER (5 pins)
~{AMPMIC_SHDN}: S01-INTERFACES (U1.4), S03-MICROPHONE (U3.2)
~{DAC_LAT}: S01-INTERFACES (U1.5), S04-SPEAKER (U5.6)
~{DAC_SPICS}: S01-INTERFACES (J1.3), S04-SPEAKER (R5.1 U5.2)
AMPMIC_AR: S01-INTERFACES (U1.7), S03-MICROPHONE (U3.9)
AMPMIC_GAIN: S01-INTERFACES (U1.6), S03-MICROPHONE (U3.10)
AMPSPK_SDZ: S01-INTERFACES (U1.8), S04-SPEAKER (U4.18)
AUDIO_MICOUT: S01-INTERFACES (J2.17), S03-MICROPHONE (U3.6)
I2CBUS_B_SCL: S01-INTERFACES (J1.18 U1.22), S04-SPEAKER (U4.17)
I2CBUS_B_SDA: S01-INTERFACES (J1.16 U1.23), S04-SPEAKER (U4.19)
SPIBUS_B_CLK: S01-INTERFACES (J1.6), S04-SPEAKER (U5.9)
SPIBUS_B_MISO: S01-INTERFACES (J1.8), S04-SPEAKER (U5.8)
SPIBUS_B_MOSI: S01-INTERFACES (J1.4), S04-SPEAKER (U5.10)